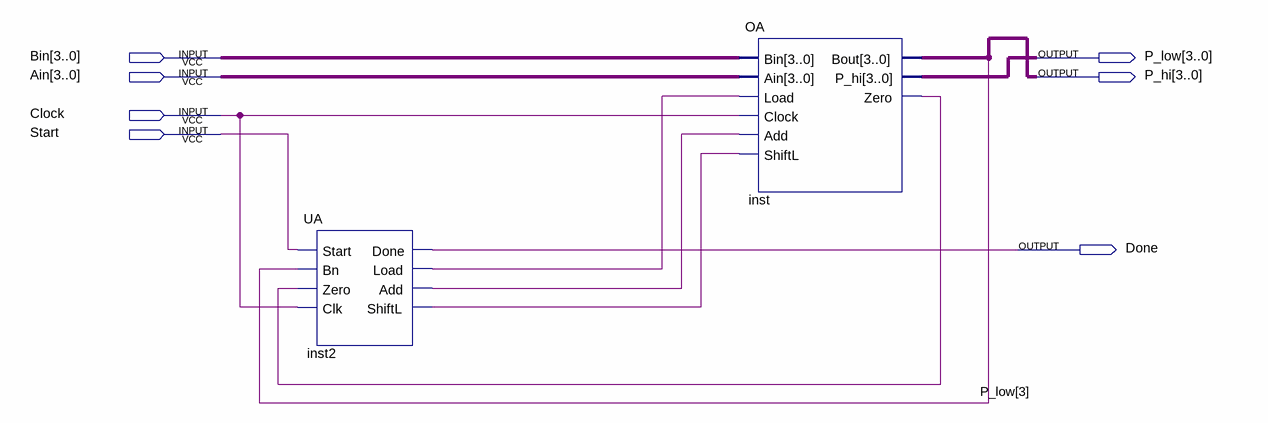
[diagram p0: schematic sheet]
// Quartus schematic TA2_2.bdf as structural Verilog: 2 symbols, 7 pins
module TA2_2 (
  input  [3:0] Bin,
  input  [3:0] Ain,
  input  Clock,
  input  Start,
  output [3:0] P_low,
  output [3:0] P_hi,
  output Done
);

  wire inst2_add, inst2_load, inst2_shiftl, inst_zero;

  UA inst2 (
    .Start(Start), .Bn(P_low[3]), .Zero(inst_zero), .Clk(Clock), .Done(Done), .Load(inst2_load),
    .Add(inst2_add), .ShiftL(inst2_shiftl));
  OA inst (
    .Bin(Bin), .Ain(Ain), .Load(inst2_load), .Clock(Clock), .Add(inst2_add), .ShiftL(inst2_shiftl),
    .Bout(P_hi), .P_hi(P_low), .Zero(inst_zero));
endmodule
